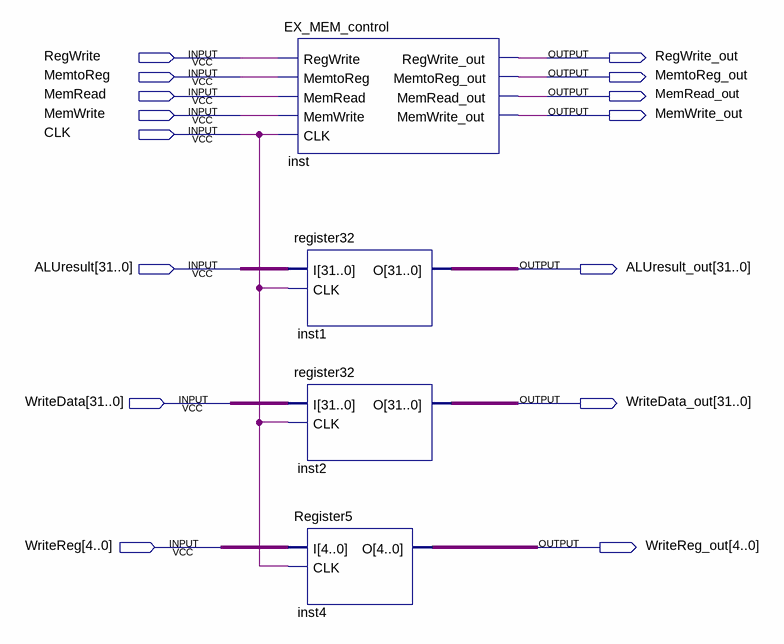
[diagram p0: schematic sheet]
// Quartus schematic EX_MEM.bdf as structural Verilog: 4 symbols, 15 pins
module EX_MEM (
  input  RegWrite,
  input  MemtoReg,
  input  MemRead,
  input  MemWrite,
  input  CLK,
  input  [31:0] ALUresult,
  input  [31:0] WriteData,
  input  [4:0] WriteReg,
  output RegWrite_out,
  output MemtoReg_out,
  output MemRead_out,
  output MemWrite_out,
  output [31:0] ALUresult_out,
  output [31:0] WriteData_out,
  output [4:0] WriteReg_out
);

  EX_MEM_control inst (
    .RegWrite(RegWrite), .MemtoReg(MemtoReg), .MemRead(MemRead), .MemWrite(MemWrite), .CLK(CLK),
    .RegWrite_out(RegWrite_out), .MemtoReg_out(MemtoReg_out), .MemRead_out(MemRead_out),
    .MemWrite_out(MemWrite_out));
  register32 inst1 (.I(ALUresult), .CLK(CLK), .O(ALUresult_out));
  register32 inst2 (.I(WriteData), .CLK(CLK), .O(WriteData_out));
  Register5 inst4 (.I(WriteReg), .CLK(CLK), .O(WriteReg_out));
endmodule
